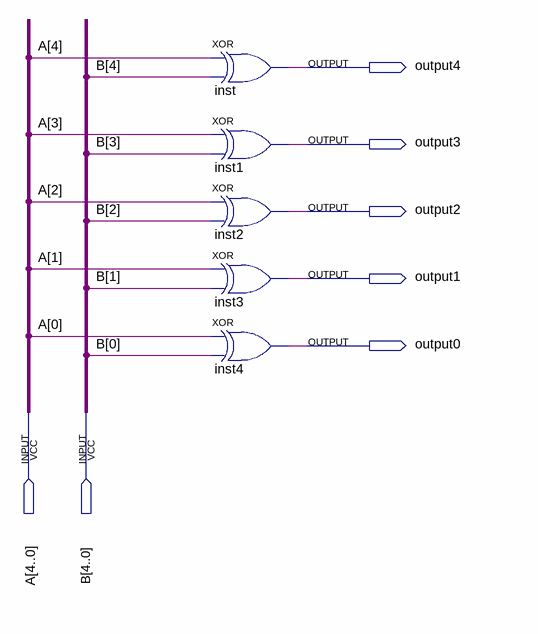
[diagram p0: schematic sheet]
// Quartus schematic a_xor_b.bdf as structural Verilog: 5 symbols, 7 pins
module a_xor_b (
  input  [4:0] A,
  input  [4:0] B,
  output output4,
  output output3,
  output output2,
  output output1,
  output output0
);

  xor inst (output4, A[4], B[4]);
  xor inst1 (output3, A[3], B[3]);
  xor inst2 (output2, A[2], B[2]);
  xor inst3 (output1, A[1], B[1]);
  xor inst4 (output0, A[0], B[0]);
endmodule
